# Altium schematic sheet [05] - RF READER.SchDoc: Desk Digital Clock
size A4; DrawnBy: Ramil Teregulov; Address1: http://github.com/teregulov; Address2: http://github.com/teregulov/Desk-Digital-Clock; DocumentNumber: DDC-5; Revision: 1R0; SheetNumber: 5; SheetTotal: 7
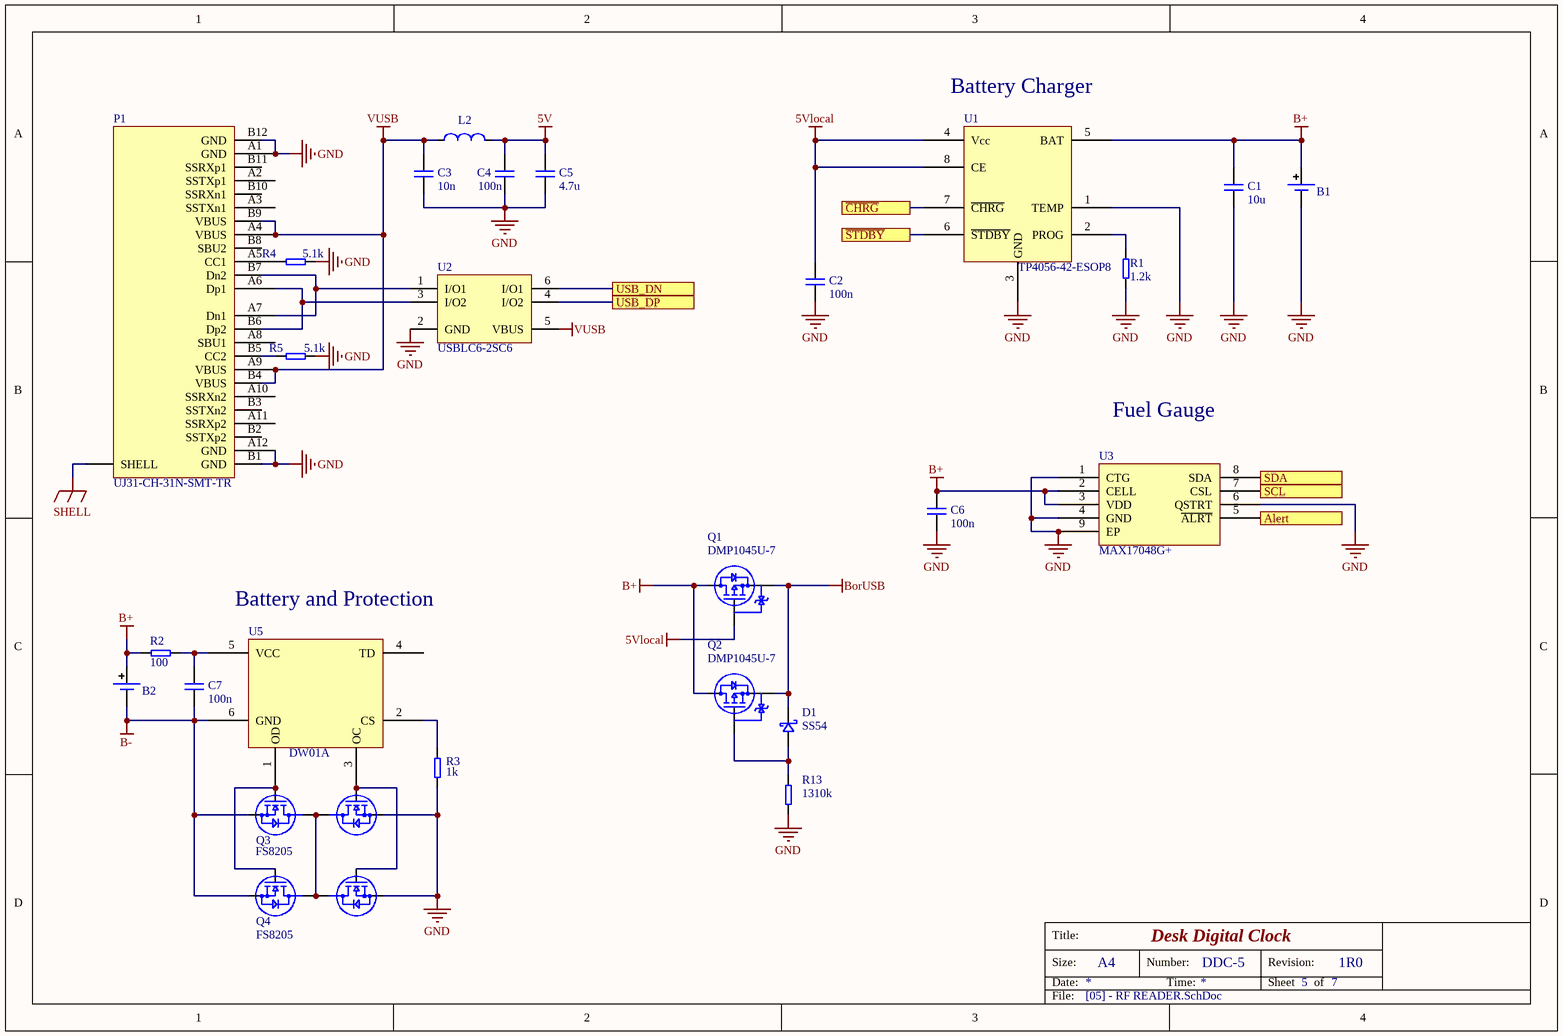
[diagram p0: [05] - RF READER.SchDoc]

## Parts
B1  (no value)
B2  (no value)
C1  10u  [C0603]
C2  100n  [C0603]
C3  10n  [C0603]
C4  100n  [C0603]
C5  4.7u  [C0603]
C6  100n  [C0603]
C7  100n  [C0603]
D1  P/N: SS54  [DIOM6959X26N-SS54]
L2  (no value)  [C0805]
P1  UJ31-CH-31N-SMT-TR  [UJ31-CH-31N-SMT-TR]
Q1  DMP1045U-7  [SOT23127P600-8N]
Q2  DMP1045U-7  [SOT23127P600-8N]
Q3  FS8205  [SOT23-6-MT3420C]
Q4  FS8205  [SOT23-6-MT3420C]
R1  1.2k  [R0603]
R2  100  [R0603]
R3  1k  [R0603]
R4  5.1k  [R0603]
R5  5.1k  [R0603]
R13  1310k  [R0603]
U1  TP4056-42-ESOP8  [TP4056-SOIC8-TP]
U2  USBLC6-2SC6  [SOT23-6L-USBLC6-2SC6]
U3  MAX17048G+  [8 TDFN-EP-MAX17048G+]
U5  DW01A  [SOT23-6-MT3420C]

## Ports
Alert, SCL, SDA, USB_DN, USB_DP, ~{CHRG}, ~{STDBY}

## Nets
5V: C4.2 C5.2 L2.2
5Vlocal: C2.2 Q1.G U1.4(Vcc) U1.8(CE)
B+: B1.2 B2.2 C1.2 C6.2 Q1.D Q2.D R2.2 U1.5(BAT) U3.2(CELL) U3.3(VDD)
B-: B2.1 C7.1 Q3.1(S1) Q4.1(S1) U5.6(GND)
BorUSB: D1.1 Q1.S Q2.S
GND: B1.1 C1.1 C2.1 C3.1 C4.1 C5.1 C6.1 P1.A1(GND) P1.A12(GND) P1.B1(GND) P1.B12(GND) Q3.3(S2) Q4.3(S2) R1.1 R3.1 R4.1 R5.1 R13.1 U1.1(TEMP) U1.3(GND) U2.2(GND) U3.1(CTG) U3.4(GND) U3.6(QSTRT) U3.9(EP)
SHELL: P1.0(SHELL)
VUSB: C3.2 L2.1 P1.A4(VBUS) P1.A9(VBUS) P1.B4(VBUS) P1.B9(VBUS) U2.5(VBUS)
Alert: U3.5(~{ALRT}) ; port Alert
~{CHRG}: U1.7(~{CHRG}) ; port ~{CHRG}
~{STDBY}: U1.6(~{STDBY}) ; port ~{STDBY}
SCL: U3.7(CSL) ; port SCL
SDA: U3.8(SDA) ; port SDA
USB_DN: U2.6(I/O1) ; port USB_DN
USB_DP: U2.4(I/O2) ; port USB_DP
NetC7_2: C7.2 R2.1 U5.5(VCC)
NetD1_2: D1.2 Q2.G R13.2
NetP1_A5: P1.A5(CC1) R4.2
NetP1_A6: P1.A6(Dp1) P1.B6(Dp2) U2.3(I/O2)
NetP1_A7: P1.A7(Dn1) P1.B7(Dn2) U2.1(I/O1)
NetP1_B5: P1.B5(CC2) R5.2
NetQ3_2: Q3.2(D12) Q3.5(D12) Q4.2(D12) Q4.5(D12)
NetQ3_4: Q3.4(G2) Q4.4(G2) U5.3(OC)
NetQ3_6: Q3.6(G1) Q4.6(G1) U5.1(OD)
NetR1_2: R1.2 U1.2(PROG)
NetR3_2: R3.2 U5.2(CS)

Not connected (* = marked no-connect by the designer): P1 A2(SSTXp1) A3(SSTXn1) A8(SBU1) A10(SSRXn2) A11(SSRXp2) B2(SSTXp2) B3(SSTXn2) B8(SBU2) B10(SSRXn1) B11(SSRXp1); U5 4(TD)

## Notes on the sheet
- (near U1) Battery Charger
- Fuel Gauge
- (near U5) Battery and Protection
- Title:
- Size:
- Date:
- A4
- Number:
- Time:
- Revision:
- Sheet
- of
- File:

## Library data of the parts
B1 B2 = Bat: BATTERY
C1-C7 = Cap: CAPACITOR
  C1: Value: 10u
  C2 C4 C6 C7: Value: 100n
  C3: Value: 10n
  C5: Value: 4.7u
D1 = Diode_Shottky: Diode Shottky; Datasheet: https://static.chipdip.ru/lib/321/DOC005321659.pdf
L2 = Ind: Ferrite Bead; P/N: blm21pg221s
P1 = UJ31-CH-31N-SMT-TR: CONN RCPT USB3.1 TYPEC 24POS R/A; Manufacturer: CUI Devices; Datasheet: https://www.cuidevices.com/product/resource/uj31-ch-smt.pdf; P/N: UJ31-CH-31N-SMT-TR
Q1 Q2 = DMP1045U-7: P-CHANNEL ENHANCEMENT MODE MOSFET; Manufacturer: Diodes Incorporated; P/N: DMP1045U-7; Datasheet: https://www.diodes.com/assets/Datasheets/DMP1045U.pdf
Q3 Q4 = FS8205: Dual n-Channel Enhancement Mode power MOSFET; Manufacturer: Fortune; P/N: FS8205; Datasheet: https://datasheet.lcsc.com/lcsc/1810110910_Fortune-Semicon-FS8205_C32254.pdf
R1-R5 R13 = Res: RESISTOR
  R1: Value: 1.2k
  R2: Value: 100
  R3: Value: 1k
  R4 R5: Value: 5.1k
  R13: Value: 1310k
U1 = TP4056-42-ESOP8: 1A Standalone Linear Li-lon Battery Charger with Thermal / Regulation in SOP-8; Manufacturer: TopPower; P/N: TP4056-42-ESOP8; Datasheet: https://datasheet.lcsc.com/lcsc/1809261820_TOPPOWER-Nanjing-Extension-Microelectronics-TP4056-42-ESOP8_C16581.pdf; Datasheet_EN: https://dlnmh9ip6v2uc.cloudfront.net/datasheets/Prototyping/TP4056.pdf*
U2 = USBLC6-2SC6: TVS DIODE 5.25V 17V SOT23-6; Manufacturer: STMicroelectronics; Datasheet: https://www.st.com/content/ccc/resource/technical/document/datasheet/06/1d/48/9c/6c/20/4a/b2/CD00050750.pdf/files/CD00050750.pdf/jcr:content/translations/en.CD00050750.pdf; P/N: USBLC6-2SC6
U3 = MAX17048G+: Micropower 1 Cell Li+ ModelFuel Gauge; Manufacturer: Maxim Integrated; P/N: MAX17048G+; Datasheet: https://datasheetspdf.com/pdf-file/929924/MaximIntegrated/MAX17048/1
U5 = DW01A: 2A 2.3-6V Input 1.5MHz Synchronous Step-Down Converter; Manufacturer: HMsemi; Datasheet: https://hmsemi.com/downfile/DW01A.PDF; P/N: DW01A